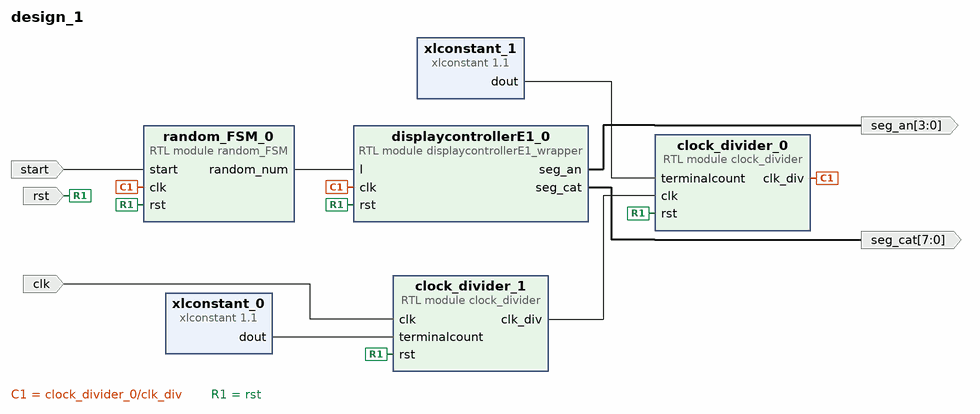
[diagram p0: block diagram of the top level]
# Vivado block design design_1, xc7z007sclg400-1, Vivado 2024.1.1
create_bd_design design_1

create_bd_port -dir O -from 3 -to 0 seg_an
create_bd_port -dir O -from 7 -to 0 seg_cat
create_bd_port -dir I clk
create_bd_port -dir I rst
create_bd_port -dir I start

create_bd_cell -type module -reference displaycontrollerE1_wrapper displaycontrollerE1_0
create_bd_cell -type module -reference random_FSM random_FSM_0
create_bd_cell -type module -reference clock_divider clock_divider_0
create_bd_cell -type module -reference clock_divider clock_divider_1
create_bd_cell -type ip -vlnv xilinx.com:ip:xlconstant:1.1 xlconstant_0
set_property -dict {CONFIG.CONST_VAL 6250 CONFIG.CONST_WIDTH 17} [get_bd_cells xlconstant_0]
create_bd_cell -type ip -vlnv xilinx.com:ip:xlconstant:1.1 xlconstant_1
set_property -dict {CONFIG.CONST_VAL 50000 CONFIG.CONST_WIDTH 17} [get_bd_cells xlconstant_1]

# ---- connections ----

connect_bd_net [get_bd_ports clk] [get_bd_pins clock_divider_1/clk]
connect_bd_net [get_bd_pins clock_divider_0/clk_div] [get_bd_pins random_FSM_0/clk] [get_bd_pins displaycontrollerE1_0/clk]
connect_bd_net [get_bd_pins clock_divider_1/clk_div] [get_bd_pins clock_divider_0/clk]
connect_bd_net [get_bd_pins displaycontrollerE1_0/seg_an] [get_bd_ports seg_an]
connect_bd_net [get_bd_pins displaycontrollerE1_0/seg_cat] [get_bd_ports seg_cat]
connect_bd_net [get_bd_pins random_FSM_0/random_num] [get_bd_pins displaycontrollerE1_0/I]
connect_bd_net [get_bd_ports rst] \
  [get_bd_pins random_FSM_0/rst] [get_bd_pins displaycontrollerE1_0/rst] [get_bd_pins clock_divider_1/rst] \
  [get_bd_pins clock_divider_0/rst]
connect_bd_net [get_bd_ports start] [get_bd_pins random_FSM_0/start]
connect_bd_net [get_bd_pins xlconstant_0/dout] [get_bd_pins clock_divider_1/terminalcount]
connect_bd_net [get_bd_pins xlconstant_1/dout] [get_bd_pins clock_divider_0/terminalcount]

validate_bd_design
save_bd_design
